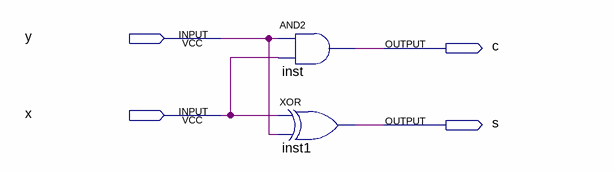
[diagram p0: schematic sheet]
// Quartus schematic HA-1BIT.bdf as structural Verilog: 2 symbols, 4 pins
module \HA-1BIT  (
  input  y,
  input  x,
  output c,
  output s
);

  and inst (c, y, x);
  xor inst1 (s, x, y);
endmodule
